# EAGLE design PinguinoUCAB (EAGLE 6.1)
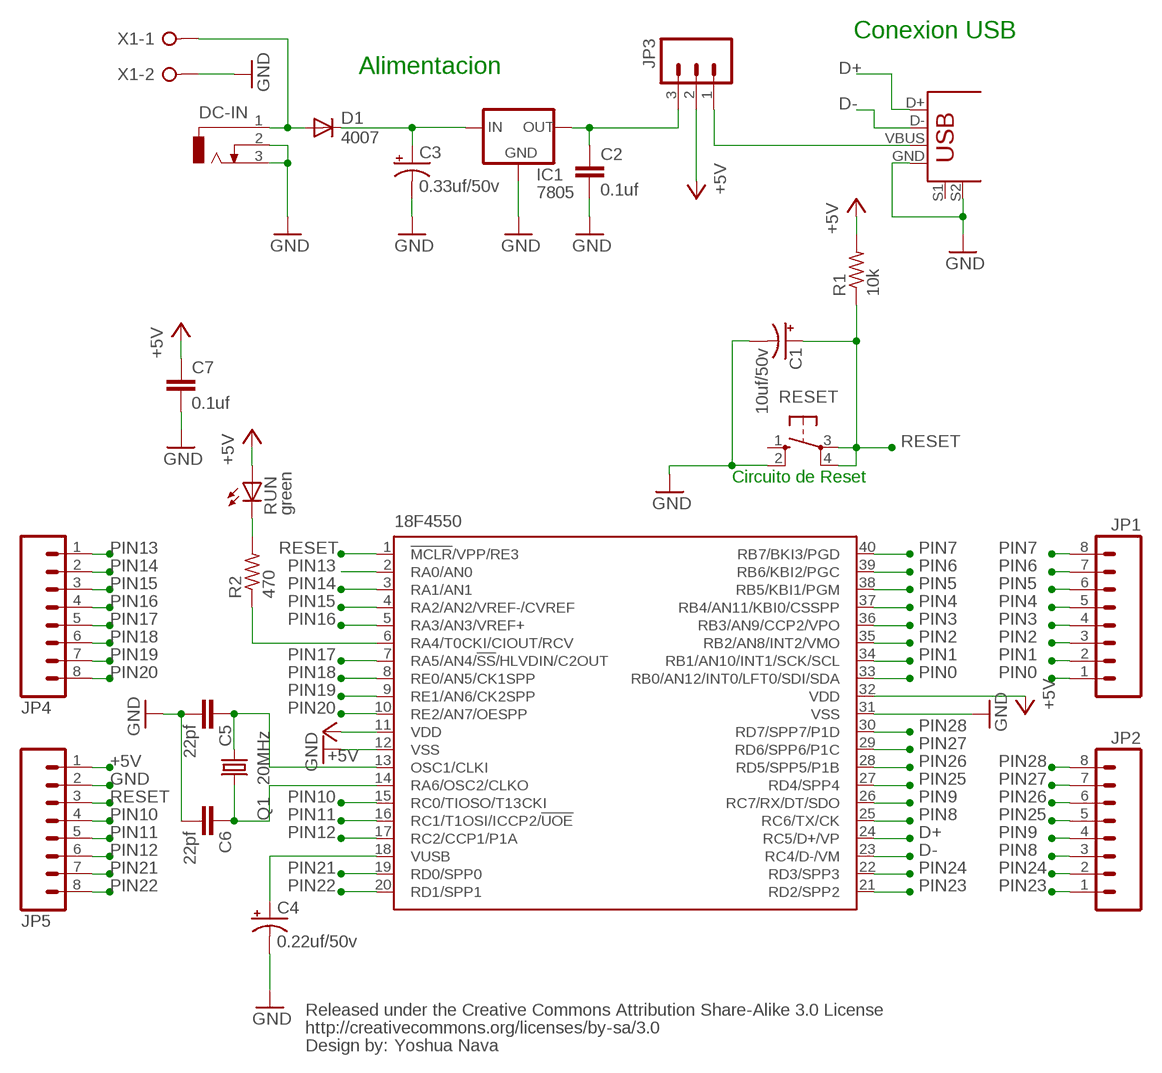
[diagram p0: schematic, sheet 1]

## Parts
18F4550  PIC18F4550_40  [DIL40]
C1  10uf/50v  CAP_POLPTH2  [CPOL-RADIAL-10UF-25V]
C2  0.1uf  CAPPTH2  [CAP-PTH-SMALL2]
C3  0.33uf/50v  CAP_POLPTH2  [CPOL-RADIAL-10UF-25V]
C4  0.22uf/50v  CAP_POLPTH2  [CPOL-RADIAL-10UF-25V]
C5  22pf  CAPPTH2  [CAP-PTH-SMALL2]
C6  22pf  CAPPTH2  [CAP-PTH-SMALL2]
C7  0.1uf  CAPPTH2  [CAP-PTH-SMALL2]
CC_TEXT1  CREATIVE_COMMONS  [CREATIVE_COMMONS]
D1  4007  1N4148DO35-7  [DO35-7]
DC-IN  DCJ0303  [DCJ0303]
IC1  7805  78XXL  [78XXL]
JP1  M08LONGPADS  [1X08_LONGPADS]
JP2  M08LONGPADS  [1X08_LONGPADS]
JP3  M03LONGPADS  [1X03_LONGPADS]
JP4  M08LONGPADS  [1X08_LONGPADS]
JP5  M08LONGPADS  [1X08_LONGPADS]
Q1  20MHz  CRYSTALHC49U-V  [HC49U-V]
R1  10k  R-US_0207/7  [0207/7]
R2  470  R-US_0207/7  [0207/7]
RESET  10-XX  [B3F-10XX]
RUN  green  LED3MM  [LED3MM]
USB  USB+SHIELD  [USB-B-PTH]
X1  W237-02P  [W237-132]

## Nets
+5V: 18F4550.11(VDD) 18F4550.32(VDD) C7.1 JP3.2 JP5.1 R1.2 RUN.A
D+: 18F4550.24(RC5/D+/VP) USB.D+
D-: 18F4550.23(RC4/D-/VM) USB.D-
GND: 18F4550.12(VSS) 18F4550.31(VSS) C1.2(-) C2.2 C3.2(-) C4.2(-) C5.2 C6.2 C7.2 DC-IN.2 DC-IN.3 IC1.GND JP5.2 RESET.2(S1) USB.GND USB.S2 X1.2
N$1: 18F4550.13(OSC1/CLKI) C5.1 Q1.1
N$2: C3.1(+) D1.C IC1.IN
N$3: C2.1 IC1.OUT JP3.3
N$4: JP3.1 USB.VBUS
N$5: 18F4550.14(RA6/OSC2/CLKO) C6.1 Q1.2
N$6: 18F4550.18(VUSB) C4.1(+)
N$7: R2.2 RUN.K(C)
N$8: 18F4550.6(RA4/T0CKI/CIOUT/RCV) R2.1
N$11: D1.A DC-IN.1 X1.1
PIN0: 18F4550.33(RB0/AN12/INT0/LFT0/SDI/SDA) JP1.1
PIN1: 18F4550.34(RB1/AN10/INT1/SCK/SCL) JP1.2
PIN2: 18F4550.35(RB2/AN8/INT2/VMO) JP1.3
PIN3: 18F4550.36(RB3/AN9/CCP2/VPO) JP1.4
PIN4: 18F4550.37(RB4/AN11/KBI0/CSSPP) JP1.5
PIN5: 18F4550.38(RB5/KBI1/PGM) JP1.6
PIN6: 18F4550.39(RB6/KBI2/PGC) JP1.7
PIN7: 18F4550.40(RB7/BKI3/PGD) JP1.8
PIN8: 18F4550.25(RC6/TX/CK) JP2.3
PIN9: 18F4550.26(RC7/RX/DT/SDO) JP2.4
PIN10: 18F4550.15(RC0/TIOSO/T13CKI) JP5.4
PIN11: 18F4550.16(RC1/T1OSI/ICCP2/!UOE) JP5.5
PIN12: 18F4550.17(RC2/CCP1/P1A) JP5.6
PIN13: 18F4550.2(RA0/AN0) JP4.1
PIN14: 18F4550.3(RA1/AN1) JP4.2
PIN15: 18F4550.4(RA2/AN2/VREF-/CVREF) JP4.3
PIN16: 18F4550.5(RA3/AN3/VREF+) JP4.4
PIN17: 18F4550.7(RA5/AN4/!SS!/HLVDIN/C2OUT) JP4.5
PIN18: 18F4550.8(RE0/AN5/CK1SPP) JP4.6
PIN19: 18F4550.9(RE1/AN6/CK2SPP) JP4.7
PIN20: 18F4550.10(RE2/AN7/OESPP) JP4.8
PIN21: 18F4550.19(RD0/SPP0) JP5.7
PIN22: 18F4550.20(RD1/SPP1) JP5.8
PIN23: 18F4550.21(RD2/SPP2) JP2.1
PIN24: 18F4550.22(RD3/SPP3) JP2.2
PIN25: 18F4550.27(RD4/SPP4) JP2.5
PIN26: 18F4550.28(RD5/SPP5/P1B) JP2.6
PIN27: 18F4550.29(RD6/SPP6/P1C) JP2.7
PIN28: 18F4550.30(RD7/SPP7/P1D) JP2.8
RESET: 18F4550.1(!MCLR!/VPP/RE3) C1.1(+) JP5.3 R1.1 RESET.3(P) RESET.4(P1)
Unconnected: RESET.1(S) USB.S1

## Notes on the sheet
- Conexion USB
- Alimentacion
- Circuito de Reset
- Yoshua Nava

## Library data of the parts
18F4550 = microchip:PIC18F4*_40: USB Microcontrollers with nanoWatt Technology High-Performance, Enhanced Flash, 28/40/44-Pin, Source: http://ww1.microchip.com/downloads/en/devicedoc/39632c.pdf; DIGIKEY: PIC18F4550-I/P-ND; MF: MICROCHIP; MPN: PIC18F4550-I/P; OC_FARNELL: 9321357; OC_NEWARK: 74K8623
C1 C3 C4 = SparkFun:CAP_POL: Capacitor Polarized These are standard SMD and PTH capacitors. Normally 10uF, 47uF, and 100uF in electrolytic and tantalum varieties. Always verify the external diameter of the through hole cap, it varies with capacity, voltage, and manufacturer. The EIA devices should be standard.
C2 C5-C7 = SparkFun:CAP: Capacitor Standard 0603 ceramic capacitor, and 0.1" leaded capacitor.
CC_TEXT1 = SparkFun-Aesthetics:CREATIVE_COMMONS: Creative Commons License summary
D1 = diode:1N4148: DIODE high speed (Philips)
DC-IN = jack:DCJ0303: DC POWER JACK Source: DCJ0303.pdf; OC_FARNELL: unknown; OC_NEWARK: unknown
IC1 = v-reg:78XXL: VOLTAGE REGULATOR
JP1 JP2 JP4 JP5 = SparkFun:M08: Header 8 Standard 8-pin 0.1" header. Use with straight break away headers (SKU : PRT-00116), right angle break away headers (PRT-00553), swiss pins (PRT-00743), machine pins (PRT-00117), and female headers (PRT-00115).
JP3 = SparkFun:M03: Header 3 Standard 3-pin 0.1" header. Use with straight break away headers (SKU : PRT-00116), right angle break away headers (PRT-00553), swiss pins (PRT-00743), machine pins (PRT-00117), and female headers (PRT-00115). Molex polarized connector foot print use with SKU : PRT-08232 with associated crimp pins and housings.
Q1 = crystal:CRYSTAL: CRYSTAL; OC_FARNELL: 1666969; OC_NEWARK: unknown
R1 R2 = resistor:R-US_: RESISTOR, American symbol
RESET = switch-omron:10-XX: OMRON SWITCH; MPN: B3F-1000; OC_FARNELL: 176432; OC_NEWARK: 36M3542
RUN = led:LED: LED OSRAM: - CHIPLED LG R971, LG N971, LY N971, LG Q971, LY Q971, LO R971, LY R971 LH N974, LH R974 LS Q976, LO Q976, LY Q976 LO Q996 - Hyper CHIPLED LW Q18S LB Q993, LB Q99A, LB R99A - SideLED LS A670, LO A670, LY A670, LG A670, LP A670 LB A673, LV A673, LT A673, LW A673 LH A674 LY A675 LS A676, LA A676, LO A676, LY A676, LW A676 LS A679, LY A679, LG A679 - Hyper Micro SIDELED® LS Y876, LA Y876, LO Y876, LY Y876 LT Y87S - SmartLED LW L88C, LW L88S LB L89C, LB L89S, LG L890 LS L89K, LO L89K, LY L89K LS L896, LA L896, LO L896, LY L896 - TOPLED LS T670, LO T670, LY T670, LG T670, LP T670 LSG T670, LSP T670, LSY T670, LOP T670, LYG T670 LG T671, LOG T671, LSG T671 LB T673, LV T673, LT T673, LW T673 LH T674 LS T676, LA T676, LO T676, LY T676, LB T676, LH T676, LSB T676, LW T676 LB T67C, LV T67C, LT T67C, LS T67K, LO T67K, LY T67K, LW E67C LS E67B, LA E67B, LO E67B, LY E67B, LB E67C, LV E67C, LT E67C LW T67C LS T679, LY T679, LG T679 LS T770, LO T770, LY T770, LG T770, LP T770 LB T773, LV T773, LT T773, LW T773 LH T774 LS E675, LA E675, LY E675, LS T675 LS T776, LA T776, LO T776, LY T776, LB T776 LHGB T686 LT T68C, LB T68C - Hyper Mini TOPLED® LB M676 - Mini TOPLED Santana® LG M470 LS M47K, LO M47K, LY M47K Source: http://www.osram.convergy.de LUXEON: - LUMILED® LXK2-PW12-R00, LXK2-PW12-S00, LXK2-PW14-U00, LXK2-PW14-V00 LXK2-PM12-R00, LXK2-PM12-S00, LXK2-PM14-U00 LXK2-PE12-Q00, LXK2-PE12-R00, LXK2-PE12-S00, LXK2-PE14-T00, LXK2-PE14-U00 LXK2-PB12-K00, LXK2-PB12-L00, LXK2-PB12-M00, LXK2-PB14-N00, LXK2-PB14-P00, LXK2-PB14-Q00 LXK2-PR12-L00, LXK2-PR12-M00, LXK2-PR14-Q00, LXK2-PR14-R00 LXK2-PD12-Q00, LXK2-PD12-R00, LXK2-PD12-S00 LXK2-PH12-R00, LXK2-PH12-S00 LXK2-PL12-P00, LXK2-PL12-Q00, LXK2-PL12-R00 Source: www.luxeon.com KINGBRIGHT: KA-3528ASYC Source: www.kingbright.com
USB = SparkFun:USB+SHIELD: USB+Shield USB connector with shield pins connectable
X1 = con-wago-508:W237-02P: WAGO SREW CLAMP; OC_FARNELL: unknown; OC_NEWARK: unknown

## Board
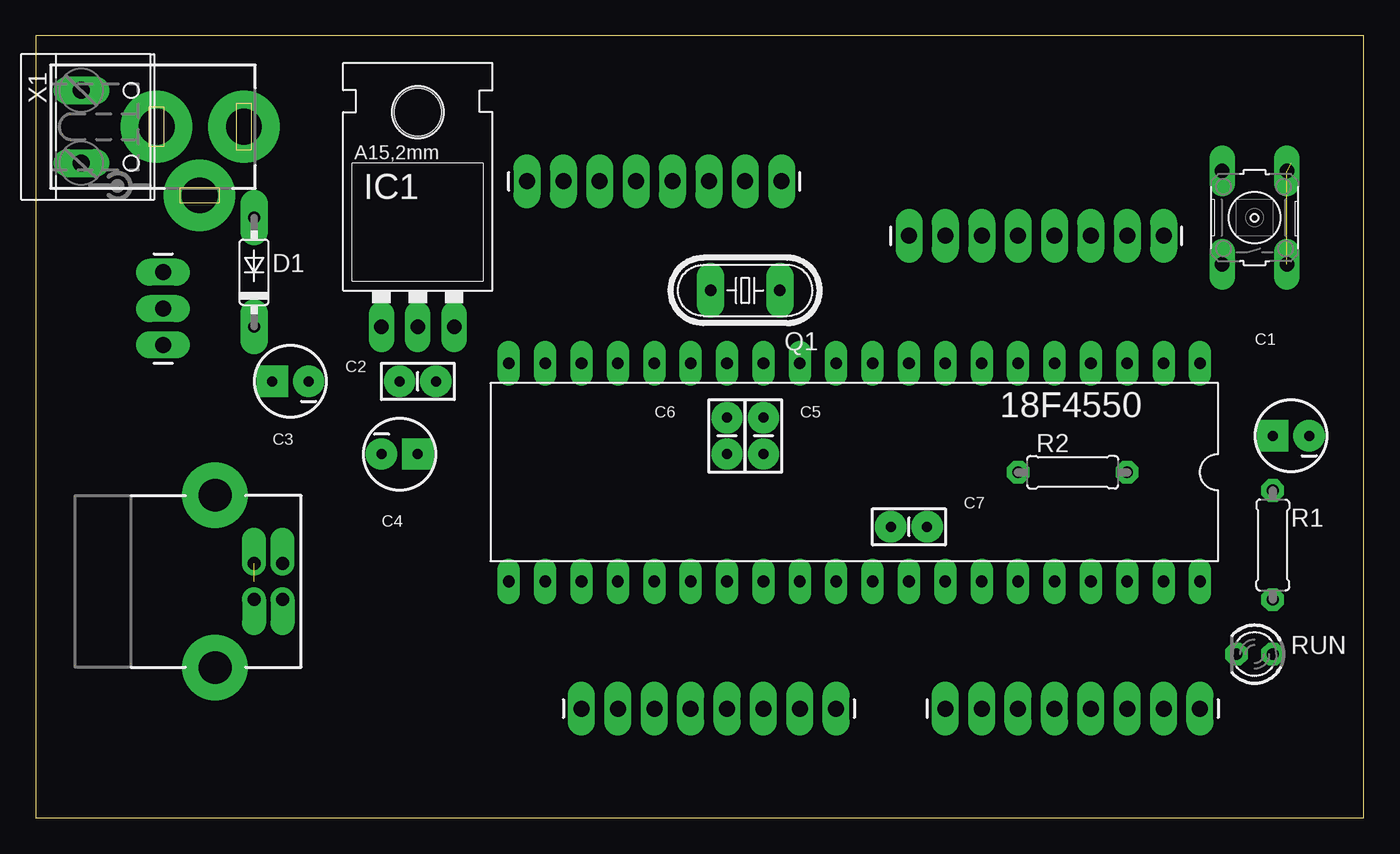
[diagram p1: board, top side]
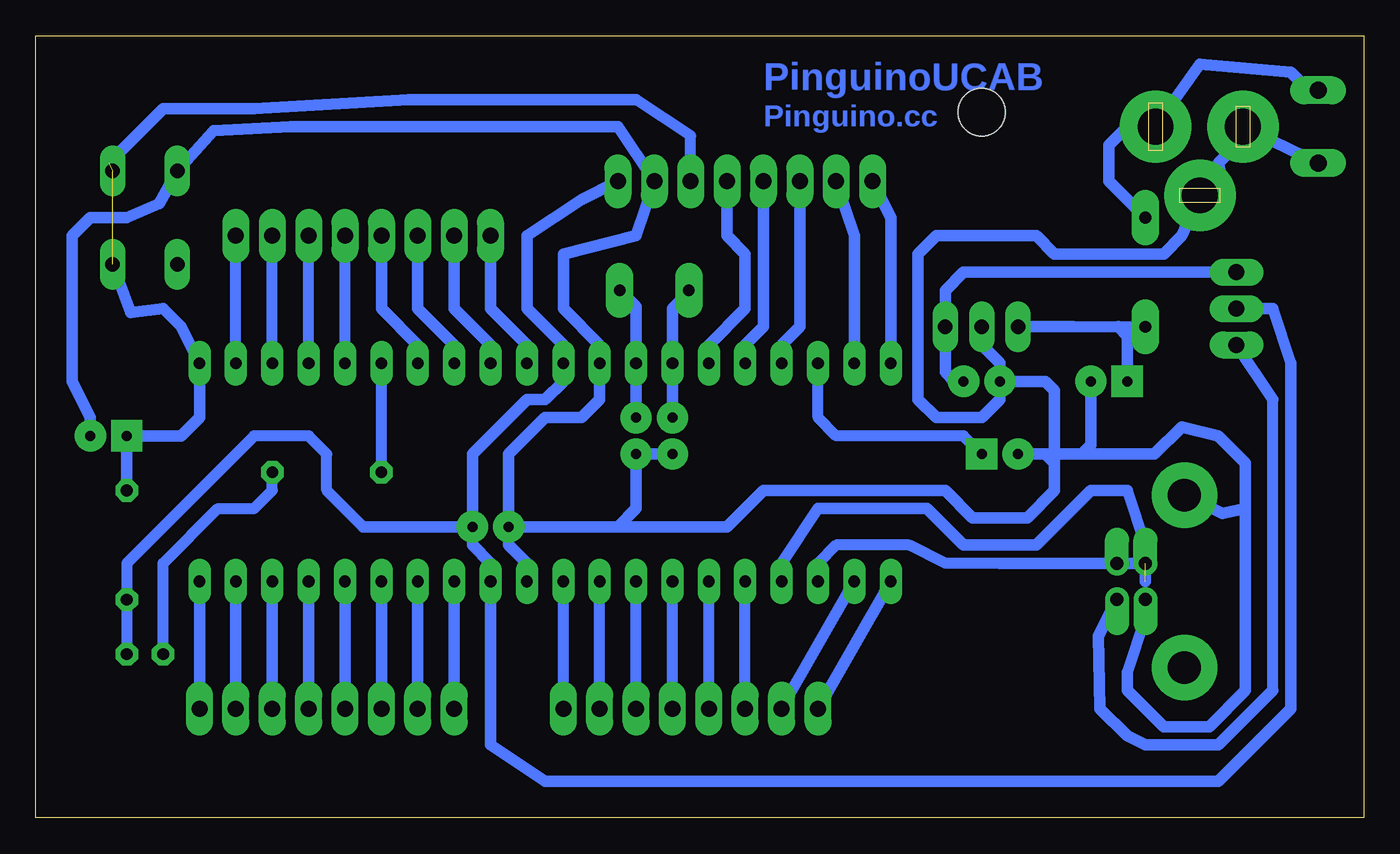
[diagram p2: board, bottom side, seen from below]

Size 92.71 x 54.61 mm. Coordinates in mm from the lower left corner, seen from the top.
Outline: 0,0 92.71,0 92.71,54.61 0,54.6 0,0
Copper layers (1*16): Top 0.035mm / dielectric 1.5mm / Bottom 0.035mm
Design rules: minimum track width 10mil, minimum drill 24mil, track to track 8mil, track to pad 8mil, pad to pad 8mil, via to via 8mil, smd to smd 8mil, copper to edge 40mil, drill to drill 8mil, minimum pad ring 15mil, minimum via ring 20mil, stop-mask expansion 4mil, vias tented up to drill 0mil, thermal gap 60mil

### Footprints (pad centres in the part's own frame; a part is rotated, then mirrored left to right if it is on the bottom)
DIL40 = drill 0.813 long: 1 -24.13,-7.62; 2 -21.59,-7.62; 3 -19.05,-7.62; 4 -16.51,-7.62; 5 -13.97,-7.62; 6 -11.43,-7.62; 7 -8.89,-7.62; 8 -6.35,-7.62; 9 -3.81,-7.62; 10 -1.27,-7.62; 11 1.27,-7.62; 12 3.81,-7.62; 13 6.35,-7.62; 14 8.89,-7.62; 15 11.43,-7.62; 16 13.97,-7.62; 17 16.51,-7.62; 18 19.05,-7.62; 19 21.59,-7.62; 20 24.13,-7.62; 21 24.13,7.62; 22 21.59,7.62; 23 19.05,7.62; 24 16.51,7.62; 25 13.97,7.62; 26 11.43,7.62; 27 8.89,7.62; 28 6.35,7.62; 29 3.81,7.62; 30 1.27,7.62; 31 -1.27,7.62; 32 -3.81,7.62; 33 -6.35,7.62; 34 -8.89,7.62; 35 -11.43,7.62; 36 -13.97,7.62; 37 -16.51,7.62; 38 -19.05,7.62; 39 -21.59,7.62; 40 -24.13,7.62
CPOL-RADIAL-10UF-25V = drill 0.7 pad 2.184 square: 1 1.27,0 | drill 0.7 pad 2.184: 2 -1.27,0
CAP-PTH-SMALL2 = drill 0.7 pad 2.184: 1 0,0; 2 2.54,0
DO35-7 = drill 0.813 pad 1.93 long: A 3.81,0; C -3.81,0
DCJ0303 = drill 2.5 pad 5: 1 0,3.1; 2 4.8,0; 3 0,-3
78XXL = drill 1.016 long: GND 0,-3.81; IN -2.54,-3.81; OUT 2.54,-3.81 | hole 3.302: 0,11.176
1X08_LONGPADS = drill 1.118 pad 1.88 long: 1 0,0; 2 2.54,0; 3 5.08,0; 4 7.62,0; 5 10.16,0; 6 12.7,0; 7 15.24,0; 8 17.78,0
1X03_LONGPADS = drill 1.118 pad 1.88 long: 1 0,0; 2 2.54,0; 3 5.08,0
HC49U-V = drill 0.813 pad 1.93 long: 1 -2.413,0; 2 2.413,0
0207/7 = drill 0.813 octagon: 1 -3.81,0; 2 3.81,0
B3F-10XX = drill 1.016 long: 1 -3.251,2.261; 2 3.251,2.261; 3 -3.251,-2.261; 4 3.251,-2.261
LED3MM = drill 0.813 octagon: A -1.27,0; K 1.27,0
USB-B-PTH = drill 0.914 pad 1.676 offset: D+ 0,1.25; D- 1.981,1.25; GND 0,-1.25; VBUS 1.981,-1.25 | drill 2.286 pad 4.572: S1 -2.718,-6.02; S2 -2.718,6.02
W237-132 = drill 1.194 long: 1 -2.54,-0.635; 2 2.54,-0.635

### Placement (x,y rotation side)
18F4550  57.15,24.13 180 top
C1  87.63,26.67 180 top
C2  27.94,30.48 180 top
C3  17.78,30.48 180 top
C4  25.4,25.4 0 top
C5  50.8,27.94 270 top
C6  48.26,27.94 270 top
C7  62.23,20.32 180 top
CC_TEXT1  27.3,-7.62 0 top  (outside the outline)
D1  15.24,38.1 90 top
DC-IN  11.43,48.26 270 top
IC1  26.67,38.1 0 top
JP1  63.5,7.62 0 top
JP2  38.1,7.62 0 top
JP3  8.89,33.02 90 top
JP4  78.74,40.64 180 top
JP5  52.07,44.45 180 top
Q1  49.53,36.83 180 top
R1  86.36,19.05 270 top
R2  72.39,24.13 0 top
RESET  85.09,41.91 90 top
RUN  85.09,11.43 180 top
USB  15.24,16.51 0 top
X1  3.81,48.26 270 top

### Tracks (layer width: path | path; a pad name or v marks a point on that pad's centre or on a via)
+5V
  Bottom 0.762: 69.85,20.32 72.39,22.86 72.39,25.4 73.66,26.67 77.47,26.67 86.36,17.78 R1.2 RUN.A
  Bottom 0.813: C7.1 69.85,20.32 | C7.1 62.23,19.05 60.96,17.78 18F4550.32 60.96,5.08 57.15,2.54 10.16,2.54 5.08,7.62 5.08,31.75 6.35,35.56 JP3.2 | JP5.1 54.61,43.18 58.42,40.64 58.42,35.56 55.88,33.02 18F4550.11 55.88,30.48 57.15,29.21 58.42,29.21 62.23,25.4 C7.1
D+  (1 unrouted)
  Bottom 0.813: 18F4550.24 40.64,17.78 38.1,21.59 30.48,21.59 27.94,19.05 22.86,19.05 19.05,22.86 16.51,22.86 15.24,19.05 15.24,16.51
D-
  Bottom 0.762: 18F4550.23 38.1,17.78 36.83,19.05 31.75,19.05 29.21,17.78 25.4,17.78
  Bottom 0.813: 25.4,17.78 21.05,17.78 USB.D- 15.97,17.78
GND
  Bottom 0.762: C2.2 25.4,29.21
  Bottom 0.813: 21.59,24.76 21.59,29.85 22.23,30.48 C2.2 25.4,31.75 26.67,33.02 IC1.GND | 22.23,25.4 C4.2 | 22.23,25.4 21.59,24.76 | 19.68,25.4 22.23,25.4 | 19.68,25.4 14.61,25.4 12.7,27.31 10.16,26.67 8.26,24.76 8.26,21.59 | C3.2 19.05,26.04 19.68,25.4 | 25.4,29.21 26.67,27.94 29.84,27.94 31.11,29.21 31.11,39.37 29.84,40.64 22.86,40.64 21.59,39.37 13.97,39.37 12.7,40.64 DC-IN.2 9.88,44.45 10.16,45.72 8.89,46.99 7.62,46.99 7.62,48.26 DC-IN.3 X1.2 | 21.59,24.76 21.59,22.86 23.5,20.95 27.3,20.95 29.21,22.86 41.91,22.86 44.45,20.32 52.07,20.32 | 8.26,21.59 8.26,8.89 10.79,6.35 13.97,6.35 16.51,8.89 16.51,10.16 15.24,13.97 USB.GND | 52.07,20.32 C7.2 | C7.2 59.69,25.4 57.15,27.94 54.61,27.94 53.34,29.21 18F4550.12 53.34,33.02 55.88,35.56 55.88,39.37 50.8,40.64 JP5.2 52.07,48.26 74.93,48.26 80.29,47.98 RESET.2 84.1,42.9 86.36,41.91 88.9,41.91 90.17,40.64 90.17,30.48 88.9,27.94 C1.2 | C7.2 59.69,19.05 58.42,17.78 18F4550.31 | USB.S2 9.86,21.26 8.26,21.59 | 52.07,20.32 50.8,21.59 C5.2 C6.2
N$1
  Bottom 0.813: 50.67,31.62 18F4550.13 | 18F4550.13 50.8,35.69 Q1.1 | C5.1 18F4550.13
N$2
  Bottom 0.762: D1.C 17.14,34.29 20.32,34.29
  Bottom 0.813: 20.32,34.29 IC1.IN | C3.1 16.51,33.66 17.14,34.29
N$3
  Bottom 0.813: C2.1 28.57,30.48 29.21,31.11 IC1.OUT 29.21,36.83 27.94,38.1 JP3.3
N$4
  Bottom 0.762: 6.35,8.89 6.35,29.21
  Bottom 0.813: 6.35,8.89 10.16,5.08 15.24,5.08 16.51,5.71 18.41,7.62 18.51,12.7 USB.VBUS | 6.35,29.21 JP3.1
N$5
  Bottom 0.813: Q1.2 47.12,36.7 48.26,35.56 18F4550.14 C6.1
N$6
  Bottom 0.762: 18F4550.18 38.1,27.94 36.83,26.67 27.94,26.67 C4.1
N$7
  Bottom 0.762: RUN.K 83.82,17.78 80.01,21.59 77.47,21.59 76.2,22.86 R2.2
N$8
  Bottom 0.762: R2.1 18F4550.6
N$11
  Bottom 0.813: X1.1 4.45,51.44 5.08,52.07 11.43,52.63 DC-IN.1 16.51,48.26 17.78,46.99 17.78,44.45 D1.A
PIN0
  Bottom 0.813: JP1.1 18F4550.33
PIN1
  Bottom 0.813: JP1.2 18F4550.34
PIN2
  Bottom 0.813: JP1.3 18F4550.35
PIN3
  Bottom 0.813: JP1.4 18F4550.36
PIN4
  Bottom 0.813: JP1.5 18F4550.37
PIN5
  Bottom 0.813: JP1.6 18F4550.38
PIN6
  Bottom 0.813: JP1.7 18F4550.39
PIN7
  Bottom 0.813: JP1.8 18F4550.40
PIN8
  Bottom 0.762: JP2.3 18F4550.25
PIN9
  Bottom 0.762: JP2.4 18F4550.26
PIN10
  Bottom 0.813: 18F4550.15 45.72,33.02 43.18,35.56 43.18,39.37 44.45,40.64 JP5.4
PIN11
  Bottom 0.813: 18F4550.16 43.18,33.02 41.91,34.29 JP5.5
PIN12
  Bottom 0.813: 18F4550.17 40.64,33.02 39.37,34.29 JP5.6
PIN13
  Bottom 0.762: 18F4550.2 JP4.1
PIN14
  Bottom 0.762: 18F4550.3 JP4.2
PIN15
  Bottom 0.762: 18F4550.4 JP4.3
PIN16
  Bottom 0.762: 18F4550.5 JP4.4
PIN17
  Bottom 0.813: 18F4550.7 66.04,33.02 68.58,35.56 JP4.5
PIN18
  Bottom 0.813: 18F4550.8 63.5,33.02 66.04,35.56 JP4.6
PIN19
  Bottom 0.813: 18F4550.9 60.96,33.02 63.5,35.56 JP4.7
PIN20
  Bottom 0.813: 18F4550.10 58.42,33.02 60.96,35.56 JP4.8
PIN21
  Bottom 0.813: 18F4550.19 35.56,40.64 JP5.7
PIN22
  Bottom 0.813: 18F4550.20 33.02,41.91 JP5.8
PIN23
  Bottom 0.813: JP2.1 18F4550.21
PIN24
  Bottom 0.762: JP2.2 18F4550.22
PIN25
  Bottom 0.762: JP2.5 18F4550.27
PIN26
  Bottom 0.762: JP2.6 18F4550.28
PIN27
  Bottom 0.762: JP2.7 18F4550.29
PIN28
  Bottom 0.762: JP2.8 18F4550.30
RESET  (2 unrouted)
  Bottom 0.762: 83.82,35.56 82.55,34.29 18F4550.1 | JP5.3 46.99,47.62 50.8,50.17
  Bottom 0.813: 50.8,50.17 66.67,50.17 77.47,49.53 83.82,49.53 87.63,45.72 | R1.1 C1.1 82.55,26.67 81.28,27.94 18F4550.1 | 83.82,35.56 86.08,35.28 RESET.3

### Text on the board
Bottom: PinguinoUCAB | Pinguino.cc
tDocu: PinguinoUCAB | Reset | PWM | PWM | RST | GND | 5v | Puertos Analógicos | A7 | A6 | A5 | A4 | A3 | A2 | A1 | A0 | + | - | DC-IN | POWER | USB | SDA | SCL | TX | RX